# Altium project Motor-20.PrjPCB
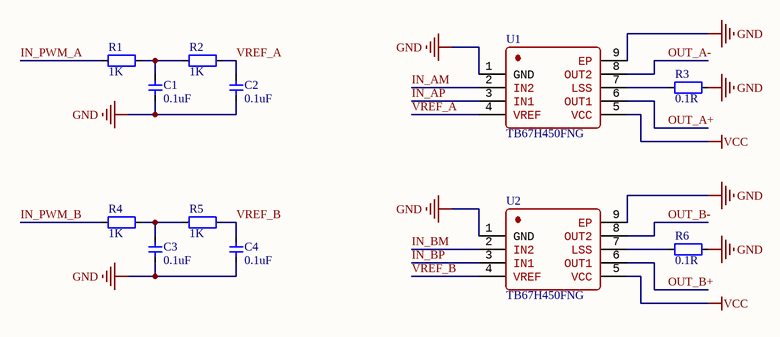
[diagram p0: Drive.SchDoc]
5 sheets, 65 parts. Net scope: global (net labels, ports and power ports of the same name join across sheets).
Board file: Motor-20.PcbDoc
Sheets:
  Drive.SchDoc
  MCU.SchDoc
  Port.SchDoc
  Power.SchDoc
  Interface.SchDoc

## Sheet Drive.SchDoc
size A4; SheetNumber: 1; SheetTotal: 1

### Parts
C1  0.1uF  [CAP_0402]
C2  0.1uF  [CAP_0402]
C3  0.1uF  [CAP_0402]
C4  0.1uF  [CAP_0402]
R1  1K  [RES_0402]
R2  1K  [RES_0402]
R3  0.1R  [1206-RES]
R4  1K  [RES_0402]
R5  1K  [RES_0402]
R6  0.1R  [1206-RES]
U1  TB67H450FNG  [SO-8-PAD]
U2  TB67H450FNG  [SO-8-PAD]

### Nets
GND: C1.1 C2.1 C3.1 C4.1 R3.2 R6.2 U1.1(GND) U1.9(EP) U2.1(GND) U2.9(EP)
VCC: U1.5(VCC) U2.5(VCC)
IN_AM: U1.2(IN2)
IN_AP: U1.3(IN1)
IN_BM: U2.2(IN2)
IN_BP: U2.3(IN1)
IN_PWM_A: R1.1
IN_PWM_B: R4.1
OUT_A+: U1.6(OUT1)
OUT_A-: U1.8(OUT2)
OUT_B+: U2.6(OUT1)
OUT_B-: U2.8(OUT2)
VREF_A: C2.2 R2.2 U1.4(VREF)
VREF_B: C4.2 R5.2 U2.4(VREF)
NetC1_2: C1.2 R1.2 R2.1
NetC3_2: C3.2 R4.2 R5.1
NetR3_1: R3.1 U1.7(LSS)
NetR6_1: R6.1 U2.7(LSS)

### Library data of the parts
C1-C4 = 电容-0402: Capacitor; Value: 0.1u
R1 R2 R4 R5 = 电阻-0402: Resistor; Value: 22R
R3 R6 = 电阻-1206: Resistor; Value: 22R
U1 U2 = TB67H450FNG: PWM Chopper Type DC Brushed Motor Driver

## Sheet MCU.SchDoc
size A4; SheetNumber: 1; SheetTotal: 1
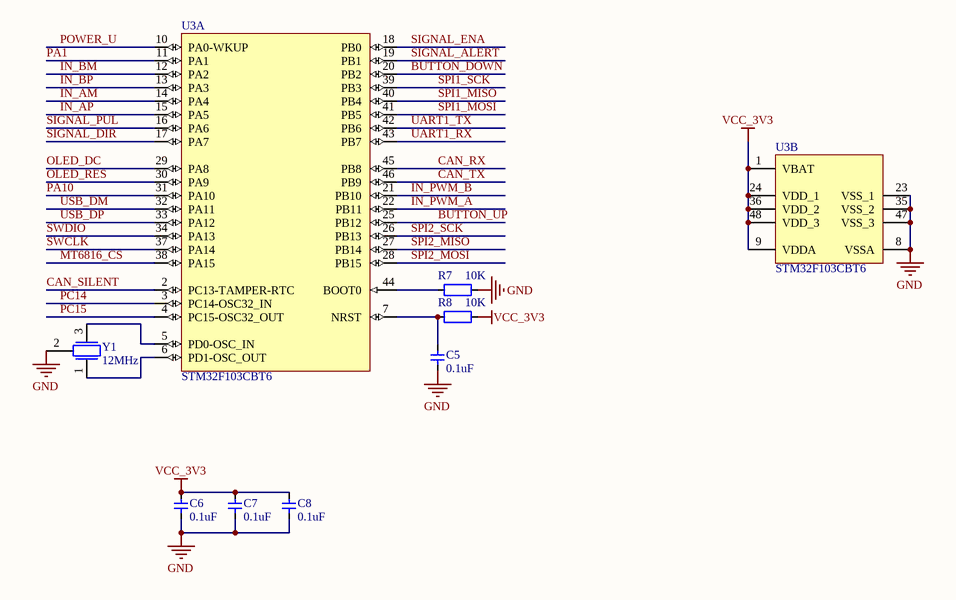
[diagram p1: MCU.SchDoc]

### Parts
C5  0.1uF  [CAP_0402]
C6  0.1uF  [CAP_0402]
C7  0.1uF  [CAP_0402]
C8  0.1uF  [CAP_0402]
R7  10K  [RES_0402]
R8  10K  [RES_0402]
U3  STM32F103CBT6  [LQFP-48]  (parts A,B of 2)
Y1  12MHz  [晶振-3P]

### Nets
GND: C5.1 C6.1 C7.1 C8.1 R7.2 U3.8(VSSA) U3.23(VSS_1) U3.35(VSS_2) U3.47(VSS_3) Y1.2
VCC_3V3: C6.2 C7.2 C8.2 R8.2 U3.1(VBAT) U3.9(VDDA) U3.24(VDD_1) U3.36(VDD_2) U3.48(VDD_3)
BUTTON_DOWN: U3.20(PB2)
BUTTON_UP: U3.25(PB12)
CAN_RX: U3.45(PB8)
CAN_SILENT: U3.2(PC13-TAMPER-RTC)
CAN_TX: U3.46(PB9)
IN_AM: U3.14(PA4)
IN_AP: U3.15(PA5)
IN_BM: U3.12(PA2)
IN_BP: U3.13(PA3)
IN_PWM_A: U3.22(PB11)
IN_PWM_B: U3.21(PB10)
MT6816_CS: U3.38(PA15)
OLED_DC: U3.29(PA8)
OLED_RES: U3.30(PA9)
PA1: U3.11(PA1)
PA10: U3.31(PA10)
PC14: U3.3(PC14-OSC32_IN)
PC15: U3.4(PC15-OSC32_OUT)
POWER_U: U3.10(PA0-WKUP)
SIGNAL_ALERT: U3.19(PB1)
SIGNAL_DIR: U3.17(PA7)
SIGNAL_ENA: U3.18(PB0)
SIGNAL_PUL: U3.16(PA6)
SPI1_MISO: U3.40(PB4)
SPI1_MOSI: U3.41(PB5)
SPI1_SCK: U3.39(PB3)
SPI2_MISO: U3.27(PB14)
SPI2_MOSI: U3.28(PB15)
SPI2_SCK: U3.26(PB13)
SWCLK: U3.37(PA14)
SWDIO: U3.34(PA13)
UART1_RX: U3.43(PB7)
UART1_TX: U3.42(PB6)
USB_DM: U3.32(PA11)
USB_DP: U3.33(PA12)
NetC5_2: C5.2 R8.1 U3.7(NRST)
NetR7_1: R7.1 U3.44(BOOT0)
NetU3_5: U3.5(PD0-OSC_IN) Y1.3
NetU3_6: U3.6(PD1-OSC_OUT) Y1.1

### Library data of the parts
C5-C8 = 电容-0402: Capacitor; Value: 0.1u
R7 R8 = 电阻-0402: Resistor; Value: 22R
U3 = STM32F103CBT6: ARM Cortex-M3 32-bit MCU, 128 KB Flash, 20 KB Internal RAM, 37 I/Os, 48-pin LQFP, -40 to 85 degC, Tray; A/D Converter: 2x12-bit (10 Channel); FLASH Size (Prog) (kB): 128; I/Os (High Current): 37; Internal RAM Size (kB): 20; Operating Frequency(F) (Processor speed) (MHz): 72; Supply Voltage(Vcc) min (V): 2; DatasheetVersion: Rev. 16; PackageVersion: Rev. 6, 06/2013; PackageReference: LQFP48; PackageDescription: 48-Pin Low Profile Quad Flat Package, 7 x 7 mm Body, 0.5 mm Pitch; Supplier 1: Digi-Key; Supplier Part Number 1: 497-6288-ND; Supplier 2: Farnell; Supplier Part Number 2: 1606327; Supplier 3: Newark; Supplier Part Number 3: 11N8296; Supplier 4: Newark; Supplier Part Number 4: 57P1214; Supplier 5: Mouser; Supplier Part Number 5: 511-STM32F103CBT6; Core: ARM Cortex-M3; Packing: Tray; Mounting Technology: Surface Mount; PartNumber: STM32F103CBT6; ComponentLink1Description: Manufacturer URL; ComponentLink1URL: http://www.st.com/web/en/home.html; ComponentLink2Description: Datasheet; ComponentLink2URL: http://www.st.com/st-web-ui/static/active/en/resource/technical/document/datasheet/CD00161566.pdf; ComponentLink3Description: Package Specification; ComponentLink3URL: http://www.st.com/st-web-ui/static/active/en/resource/technical/document/datasheet/DM00058181.pdf
Y1 = 晶振-3Pin: 村田贴片

## Sheet Port.SchDoc
size A4; SheetNumber: 1; SheetTotal: 1
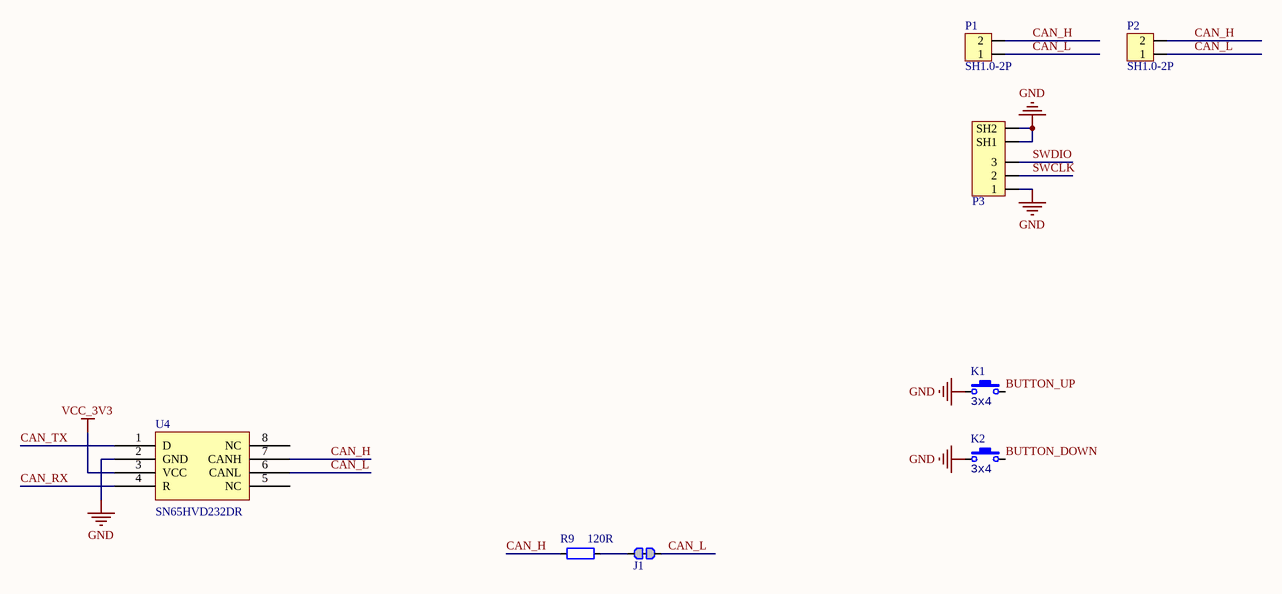
[diagram p2: Port.SchDoc]

### Parts
J1  跳线  [0402-0R]  (value not drawn)
K1  value 3x4  [ButtonTACT_3x4x2_180]  (hidden comment: TACT 2P)
K2  value 3x4  [ButtonTACT_3x4x2_180]  (hidden comment: TACT 2P)
P1  SH1.0-2P  [SH1.0-2P]
P2  SH1.0-2P  [SH1.0-2P]
P3  SH1.0-3P  [SH1.0-3P]  (value not drawn)
R9  120R  [RES_0402]
U4  Manufacturer Part Number: SN65HVD232DR  [SO-8]  (hidden comment: SN65HVD232D)

### Nets
GND: K1.1 K2.1 P3.1 P3.SH1 P3.SH2 U4.2(GND)
VCC_3V3: U4.3(VCC)
BUTTON_DOWN: K2.2
BUTTON_UP: K1.2
CAN_H: P1.2 P2.2 R9.1 U4.7(CANH)
CAN_L: J1.2 P1.1 P2.1 U4.6(CANL)
CAN_RX: U4.4(R)
CAN_TX: U4.1(D)
SWCLK: P3.2
SWDIO: P3.3
NetJ1_1: J1.1 R9.2

Not connected (* = marked no-connect by the designer): U4 5(NC) 8(NC)

### Library data of the parts
J1 = 跳线: Resistor; Published: 8-Jun-2000; LatestRevisionDate: 17-Jul-2002; LatestRevisionNote: Re-released for DXP Platform.; PackageReference: AXIAL-0.4; Publisher: Altium Limited; PackageDescription: Axial Device, Thru-Hole; 2 Leads; 0.4 in Pin Spacing
K1 K2 = ButtonTACT_3x4x2_180: Button; type: TACT 2P
P3 = SH1.0-3P: Header
R9 = 电阻-0402: Resistor; Value: 22R
U4 = SN65HVD232D: Manufacturer: Texas Instruments; Protocol: CAN; Number of Drivers/Receivers: 1/1; Duplex: Half; Data Rate: 1Mbps; Voltage - Supply: 3 V ~ 3.6 V; Supplier 1: Digi-Key; Supplier Part Number 1: 296-26344-2-ND; RoHS: RoHS Compliant; Category: Integrated Circuits (ICs); Stock: 5000; Pricing 1: 2500=0.84375 (USD); Packaging: Tape & Reel (TR); Part Status: Active; Type: Transceiver; Operating Temperature: -40°C ~ 85°C; Mounting Type: Surface Mount; Package / Case: 8-SOIC (0.154", 3.90mm Width); Supplier Device Package: 8-SOIC; ComponentLink1URL: http://www.ti.com/lit/ds/symlink/sn65hvd230.pdf; ComponentLink1Description: http://www.ti.com/lit/ds/symlink/sn65hvd230.pdf; Supplier 2: Digi-Key; Supplier Part Number 2: 296-26344-1-ND; Pricing 2: 1=2.05, 10=1.842, 100=1.4809, 500=1.21668, 1000=1.00811 (USD)

## Sheet Power.SchDoc
size A4; SheetNumber: 1; SheetTotal: 1
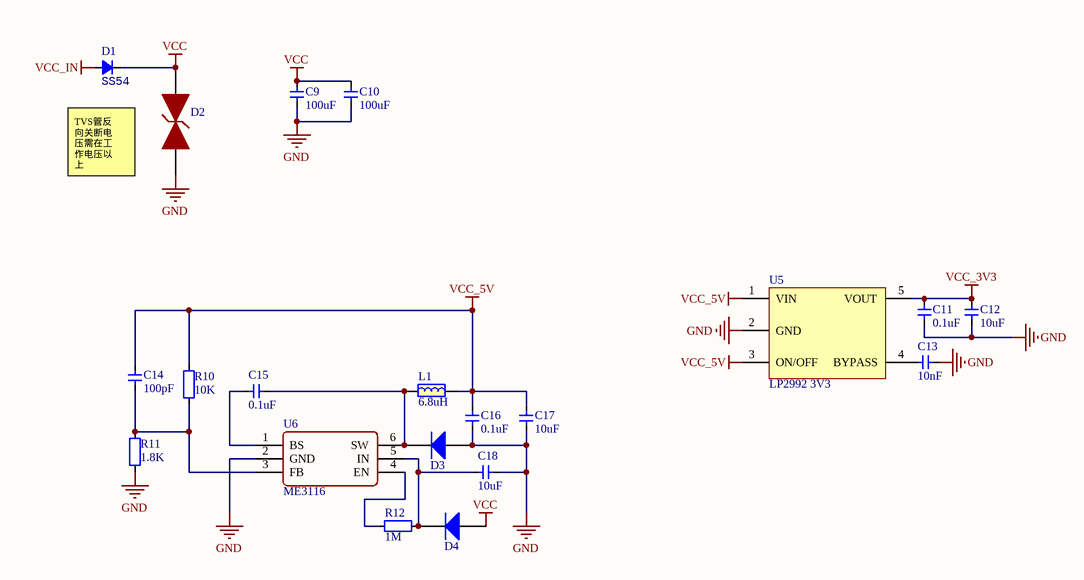
[diagram p3: Power.SchDoc]

### Parts
C9  100uF  [1206-CAP]
C10  100uF  [1206-CAP]
C11  0.1uF  [CAP_0402]
C12  10uF  [CAP_0402]
C13  10nF  [CAP_0402]
C14  100pF  [CAP_0402]
C15  0.1uF  [CAP_0402]
C16  0.1uF  [CAP_0402]
C17  10uF  [CAP_0402]
C18  10uF  [CAP_0402]
D1  SS54  [DO-214AC]
D2  SMBJ28CA  [SMBJ-CA_MFG]  (value not drawn)
D3  二极管-5819W  [SOD-323]  (value not drawn)
D4  二极管-5819W  [SOD-323]  (value not drawn)
L1  6.8uH  [IND-201612]
R10  10K  [RES_0402]
R11  1.8K  [RES_0402]
R12  1M  [RES_0402]
U5  LP2992 3V3  [SOT23-5]
U6  ME3116  [SOT23-6]

### Nets
GND: C9.1 C10.1 C11.1 C12.1 C13.1 C16.1 C17.1 C18.1 D2.1 D3.1(A) R11.1 U5.2(GND) U6.2(GND)
VCC: C9.2 C10.2 D1.2(K) D2.2 D4.1(A)
VCC_3V3: C11.2 C12.2 U5.5(VOUT)
VCC_5V: C14.1 C16.2 C17.2 L1.2 R10.2 U5.1(VIN) U5.3(ON/OFF)
VCC_IN: D1.1(A)
NetC13_2: C13.2 U5.4(BYPASS)
NetC14_2: C14.2 R10.1 R11.2 U6.3(FB)
NetC15_1: C15.1 D3.2(K) L1.1 U6.6(SW)
NetC15_2: C15.2 U6.1(BS)
NetC18_2: C18.2 D4.2(K) R12.1 U6.5(IN)
NetR12_2: R12.2 U6.4(EN)

### Notes on the sheet
- TVS管反
  向关断电
  压需在工
  作电压以
  上

### Library data of the parts
C9 C10 = 电容-1206: Capacitor; Value: 0.1u
C11-C18 = 电容-0402: Capacitor; Value: 0.1u
D1 = Diode_SMA: Diode; Type: SMA; Value: SS54
D3 D4 = 二极管-5819W: 40V
L1 = 电感-201612
R10-R12 = 电阻-0402: Resistor; Value: 22R
U5 = LP2992: LDO
U6 = ME3116: DC-DC

## Sheet Interface.SchDoc
size A4; SheetNumber: 1; SheetTotal: 1
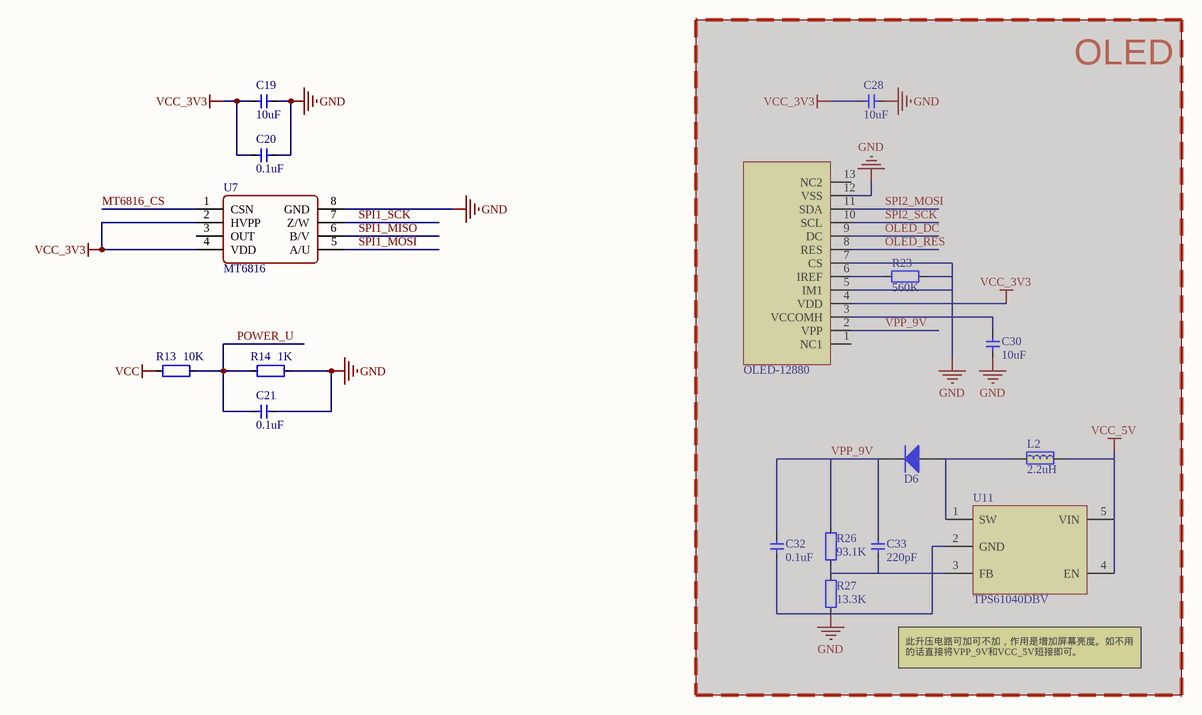
[diagram p4: Interface.SchDoc]

### Parts
1  OLED-12880  [OLED-12880]  (masked out: inside a compile mask, not in the netlist)
C19  10uF  [CAP_0402]
C20  0.1uF  [CAP_0402]
C21  0.1uF  [CAP_0402]
C28  10uF  [CAP_0402]  (masked out: inside a compile mask, not in the netlist)
C30  10uF  [CAP_0402]  (masked out: inside a compile mask, not in the netlist)
C32  0.1uF  [CAP_0402]  (masked out: inside a compile mask, not in the netlist)
C33  220pF  [CAP_0402]  (masked out: inside a compile mask, not in the netlist)
D6  二极管-5B5819WS  [SOD-323]  (value not drawn)  (masked out: inside a compile mask, not in the netlist)
L2  2.2uH  [2520-L]  (masked out: inside a compile mask, not in the netlist)
R13  10K  [RES_0402]
R14  1K  [RES_0402]
R23  560K  [RES_0402]  (masked out: inside a compile mask, not in the netlist)
R26  93.1K  [RES_0402]  (masked out: inside a compile mask, not in the netlist)
R27  13.3K  [RES_0402]  (masked out: inside a compile mask, not in the netlist)
U7  MT6816  [SO-8]
U11  TPS61040DBV  [SOT23-5]  (masked out: inside a compile mask, not in the netlist)

### Blocks framed on the sheet
OLED: 1 C28 C30 C32 C33 D6 L2 R23 R26 R27 U11

### Nets
GND: C19.1 C20.1 C21.1 R14.2 U7.8(GND)
VCC: R13.1
VCC_3V3: C19.2 C20.2 U7.2(HVPP) U7.4(VDD)
MT6816_CS: U7.1(CSN)
POWER_U: C21.2 R13.2 R14.1
SPI1_MISO: U7.6(B/V)
SPI1_MOSI: U7.5(A/U)
SPI1_SCK: U7.7(Z/W)

Not connected (* = marked no-connect by the designer): U7 3(OUT)

### Notes on the sheet
- 此升压电路可加可不加，作用是增加屏幕亮度。如不用的话直接将VPP_9V和VCC_5V短接即可。

### Library data of the parts
C19-C21 C28 C30 C32 C33 = 电容-0402: Capacitor; Value: 0.1u
D6 = 二极管-5B5817WS: 40V
L2 = 电感-2520: 磁珠
R13 R14 R23 R26 R27 = 电阻-0402: Resistor; Value: 22R
U7 = MT6816: Magnetic Position Sensor
U11 = TPS61040DBV: MP: TPS61221DCK; MF: Texas Instruments; Price: None; SnapEDA_Link: https://www.snapeda.com/parts/TPS61221DCK/Texas%20Instruments/view-part/2767825/?ref=snap; Availability: Unavailable; Value: *; Package: SOT-363 Texas Instruments

## Nets that join several sheets
GND: Drive (10 pins), MCU (10 pins), Port (6 pins), Power (13 pins), Interface (5 pins)
VCC: Drive (U1.5 U2.5), Power (5 pins), Interface (R13.1)
VCC_3V3: MCU (9 pins), Port (U4.3), Power (C11.2 C12.2 U5.5), Interface (C19.2 C20.2 U7.2 U7.4)
BUTTON_DOWN: MCU (U3.20), Port (K2.2)
BUTTON_UP: MCU (U3.25), Port (K1.2)
CAN_RX: MCU (U3.45), Port (U4.4)
CAN_TX: MCU (U3.46), Port (U4.1)
IN_AM: Drive (U1.2), MCU (U3.14)
IN_AP: Drive (U1.3), MCU (U3.15)
IN_BM: Drive (U2.2), MCU (U3.12)
IN_BP: Drive (U2.3), MCU (U3.13)
IN_PWM_A: Drive (R1.1), MCU (U3.22)
IN_PWM_B: Drive (R4.1), MCU (U3.21)
MT6816_CS: MCU (U3.38), Interface (U7.1)
POWER_U: MCU (U3.10), Interface (C21.2 R13.2 R14.1)
SPI1_MISO: MCU (U3.40), Interface (U7.6)
SPI1_MOSI: MCU (U3.41), Interface (U7.5)
SPI1_SCK: MCU (U3.39), Interface (U7.7)
SWCLK: MCU (U3.37), Port (P3.2)
SWDIO: MCU (U3.34), Port (P3.3)